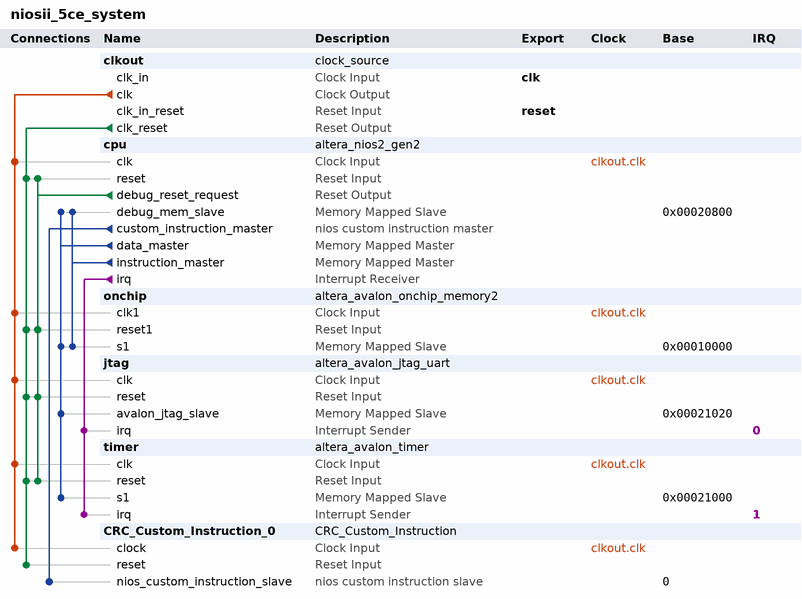
[diagram p0: system contents]
# Platform Designer (Qsys) system niosii_5ce_system, Cyclone V 5CEFA7F31I7
# Parameters at their usual value, and those the tool derives, are not listed.
package require -exact qsys 23.1
create_system niosii_5ce_system
set_project_property DEVICE_FAMILY {Cyclone V}
set_project_property DEVICE 5CEFA7F31I7

add_instance clkout clock_source 23.1
set_instance_parameter_value clkout clockFrequency 50000000

add_instance cpu altera_nios2_gen2 23.1
set_instance_parameter_value cpu dcache_size 2048
set_instance_parameter_value cpu exceptionSlave onchip.s1
set_instance_parameter_value cpu icache_size 4096
set_instance_parameter_value cpu impl Fast
set_instance_parameter_value cpu resetSlave onchip.s1

add_instance onchip altera_avalon_onchip_memory2 23.1
set_instance_parameter_value onchip dataWidth 32
set_instance_parameter_value onchip dualPort false
set_instance_parameter_value onchip initMemContent true
set_instance_parameter_value onchip initializationFileName onchip_mem.hex
set_instance_parameter_value onchip memorySize 65536

add_instance jtag altera_avalon_jtag_uart 23.1
set_instance_parameter_value jtag simInteractiveOptions NO_INTERACTIVE_WINDOWS

add_instance timer altera_avalon_timer 23.1
set_instance_parameter_value timer period 1
set_instance_parameter_value timer periodUnits MSEC

add_instance CRC_Custom_Instruction_0 CRC_Custom_Instruction 1.0
set_instance_parameter_value CRC_Custom_Instruction_0 crc_width 32
set_instance_parameter_value CRC_Custom_Instruction_0 polynomial 79764919
set_instance_parameter_value CRC_Custom_Instruction_0 polynomial_inital 4294967295
set_instance_parameter_value CRC_Custom_Instruction_0 reflected_input 1
set_instance_parameter_value CRC_Custom_Instruction_0 reflected_output 1
set_instance_parameter_value CRC_Custom_Instruction_0 xor_output 4294967295

# connections
add_connection clkout.clk cpu.clk clock
add_connection clkout.clk CRC_Custom_Instruction_0.clock clock
add_connection clkout.clk jtag.clk clock
add_connection clkout.clk onchip.clk1 clock
add_connection clkout.clk timer.clk clock
add_connection clkout.clk_reset cpu.reset reset
add_connection clkout.clk_reset CRC_Custom_Instruction_0.reset reset
add_connection clkout.clk_reset jtag.reset reset
add_connection clkout.clk_reset onchip.reset1 reset
add_connection clkout.clk_reset timer.reset reset
add_connection cpu.debug_reset_request cpu.reset reset
add_connection cpu.debug_reset_request jtag.reset reset
add_connection cpu.debug_reset_request onchip.reset1 reset
add_connection cpu.debug_reset_request timer.reset reset
add_connection cpu.data_master cpu.debug_mem_slave avalon
set_connection_parameter_value cpu.data_master/cpu.debug_mem_slave baseAddress 0x00020800
add_connection cpu.data_master jtag.avalon_jtag_slave avalon
set_connection_parameter_value cpu.data_master/jtag.avalon_jtag_slave baseAddress 0x00021020
add_connection cpu.data_master onchip.s1 avalon
set_connection_parameter_value cpu.data_master/onchip.s1 baseAddress 0x00010000
add_connection cpu.data_master timer.s1 avalon
set_connection_parameter_value cpu.data_master/timer.s1 baseAddress 0x00021000
add_connection cpu.instruction_master cpu.debug_mem_slave avalon
set_connection_parameter_value cpu.instruction_master/cpu.debug_mem_slave baseAddress 0x00020800
add_connection cpu.instruction_master onchip.s1 avalon
set_connection_parameter_value cpu.instruction_master/onchip.s1 baseAddress 0x00010000
add_connection cpu.irq jtag.irq interrupt
set_connection_parameter_value cpu.irq/jtag.irq irqNumber 0
add_connection cpu.irq timer.irq interrupt
set_connection_parameter_value cpu.irq/timer.irq irqNumber 1
add_connection cpu.custom_instruction_master CRC_Custom_Instruction_0.nios_custom_instruction_slave nios_custom_instruction
set_connection_parameter_value cpu.custom_instruction_master/CRC_Custom_Instruction_0.nios_custom_instruction_slave CIName crc_custom_instruction_0
set_connection_parameter_value cpu.custom_instruction_master/CRC_Custom_Instruction_0.nios_custom_instruction_slave baseAddress 0

# exported interfaces
add_interface clk clock sink
set_interface_property clk EXPORT_OF clkout.clk_in
add_interface reset reset sink
set_interface_property reset EXPORT_OF clkout.clk_in_reset

set_interconnect_requirement {$system} qsys_mm.clockCrossingAdapter HANDSHAKE
set_interconnect_requirement {$system} qsys_mm.enableEccProtection FALSE
set_interconnect_requirement {$system} qsys_mm.insertDefaultSlave FALSE
set_interconnect_requirement {$system} qsys_mm.maxAdditionalLatency 1

save_system niosii_5ce_system.qsys
